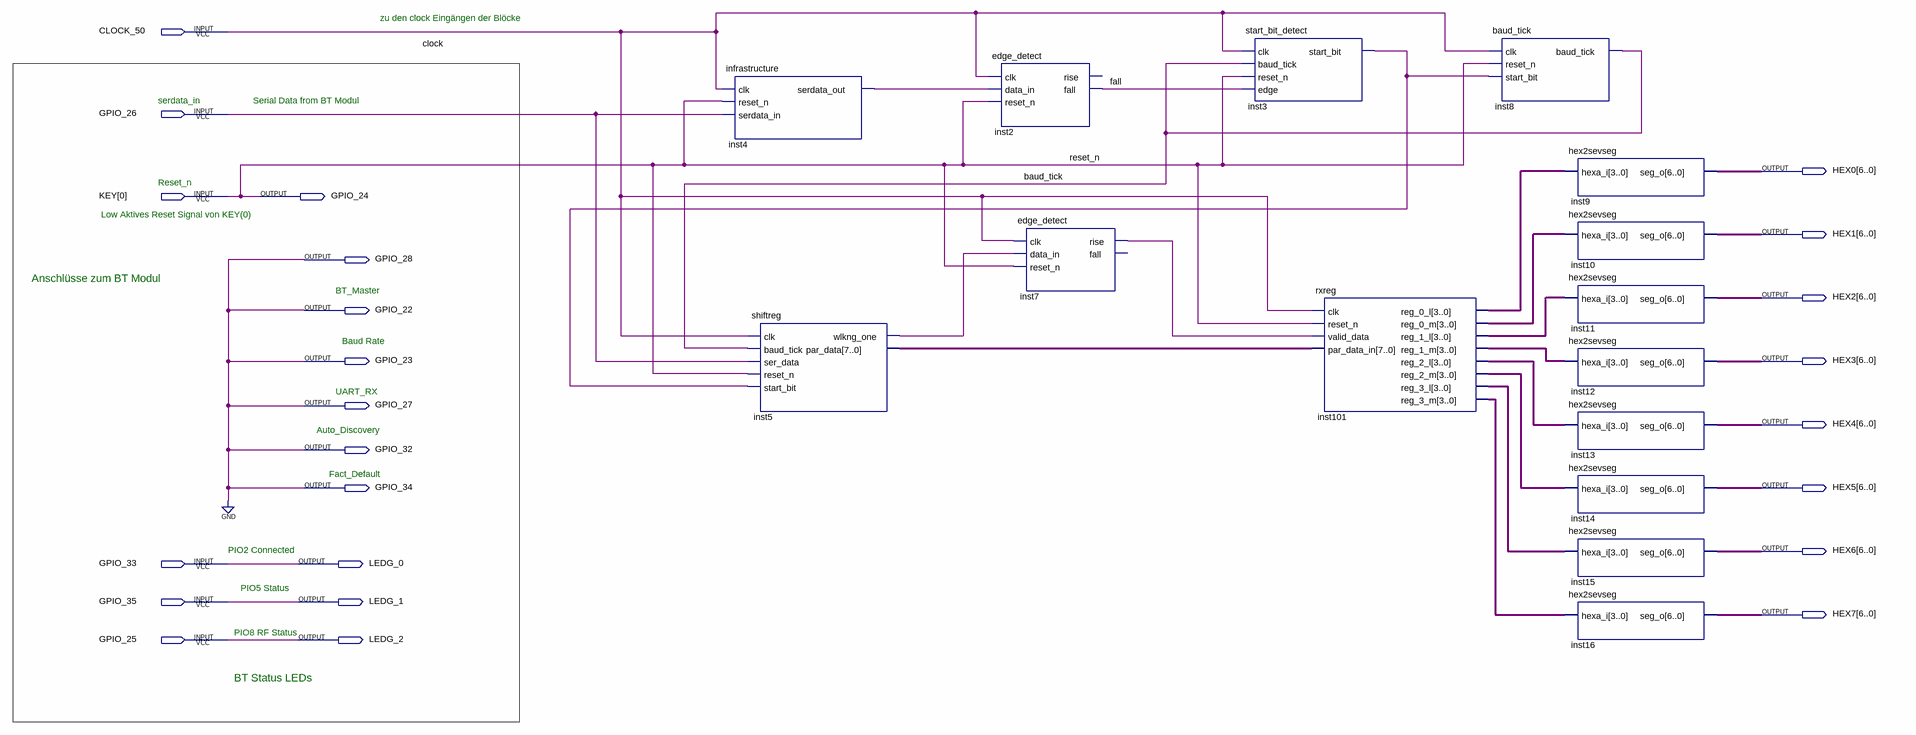
[diagram p0: schematic sheet]
// Quartus schematic bluetooth_top.bdf as structural Verilog: 15 symbols, 24 pins
module bluetooth_top (
  input  CLOCK_50,
  input  GPIO_26,
  input  [0:0] KEY,
  input  GPIO_33,
  input  GPIO_35,
  input  GPIO_25,
  output [6:0] HEX0,
  output GPIO_24,
  output [6:0] HEX1,
  output GPIO_28,
  output [6:0] HEX2,
  output GPIO_22,
  output GPIO_23,
  output [6:0] HEX3,
  output GPIO_27,
  output [6:0] HEX4,
  output GPIO_32,
  output GPIO_34,
  output [6:0] HEX5,
  output [6:0] HEX6,
  output LEDG_0,
  output LEDG_1,
  output [6:0] HEX7,
  output LEDG_2
);

  wire baud_tick, fall, inst3_start_bit, inst4_serdata_out, inst5_wlkng_one, inst7_rise;
  wire [3:0] inst101_reg_0_l, inst101_reg_0_m, inst101_reg_1_l, inst101_reg_1_m, inst101_reg_2_l,
       inst101_reg_2_m, inst101_reg_3_l, inst101_reg_3_m;
  wire [7:0] inst5_par_data;

  infrastructure inst4 (.clk(CLOCK_50), .reset_n(KEY[0]), .serdata_in(GPIO_26), .serdata_out(inst4_serdata_out));
  shiftreg inst5 (
    .clk(CLOCK_50), .baud_tick(baud_tick), .ser_data(GPIO_26), .reset_n(KEY[0]), .start_bit(inst3_start_bit),
    .wlkng_one(inst5_wlkng_one), .par_data(inst5_par_data));
  edge_detect inst2 (.clk(CLOCK_50), .data_in(inst4_serdata_out), .reset_n(KEY[0]), .fall(fall));  // open: rise
  edge_detect inst7 (.clk(CLOCK_50), .data_in(inst5_wlkng_one), .reset_n(KEY[0]), .rise(inst7_rise));  // open: fall
  start_bit_detect inst3 (
    .clk(CLOCK_50), .baud_tick(baud_tick), .reset_n(KEY[0]), .\edge (fall), .start_bit(inst3_start_bit));
  rxreg inst101 (
    .clk(CLOCK_50), .reset_n(KEY[0]), .valid_data(inst7_rise), .par_data_in(inst5_par_data),
    .reg_0_l(inst101_reg_0_l), .reg_0_m(inst101_reg_0_m), .reg_1_l(inst101_reg_1_l),
    .reg_1_m(inst101_reg_1_m), .reg_2_l(inst101_reg_2_l), .reg_2_m(inst101_reg_2_m),
    .reg_3_l(inst101_reg_3_l), .reg_3_m(inst101_reg_3_m));
  baud_tick inst8 (.clk(CLOCK_50), .reset_n(KEY[0]), .start_bit(inst3_start_bit), .baud_tick(baud_tick));
  hex2sevseg inst9 (.hexa_i(inst101_reg_0_l), .seg_o(HEX0));
  hex2sevseg inst10 (.hexa_i(inst101_reg_0_m), .seg_o(HEX1));
  hex2sevseg inst11 (.hexa_i(inst101_reg_1_l), .seg_o(HEX2));
  hex2sevseg inst12 (.hexa_i(inst101_reg_1_m), .seg_o(HEX3));
  hex2sevseg inst13 (.hexa_i(inst101_reg_2_l), .seg_o(HEX4));
  hex2sevseg inst14 (.hexa_i(inst101_reg_2_m), .seg_o(HEX5));
  hex2sevseg inst15 (.hexa_i(inst101_reg_3_l), .seg_o(HEX6));
  hex2sevseg inst16 (.hexa_i(inst101_reg_3_m), .seg_o(HEX7));

  assign GPIO_22 = 1'b0;
  assign GPIO_23 = 1'b0;
  assign GPIO_24 = KEY[0];
  assign GPIO_27 = 1'b0;
  assign GPIO_28 = 1'b0;
  assign GPIO_32 = 1'b0;
  assign GPIO_34 = 1'b0;
  assign LEDG_0 = GPIO_33;
  assign LEDG_1 = GPIO_35;
  assign LEDG_2 = GPIO_25;

  // Other names for the same wires on the sheet: clock = CLOCK_50; reset_n = KEY[0]

  // Notes on the sheet:
  //   zu den clock Eingängen der Blöcke
  //   serdata_in
  //   Serial Data from BT Modul
  //   Reset_n
  //   Low Aktives Reset Signal von KEY(0)
  //   Anschlüsse zum BT Modul
  //   BT_Master
  //   Baud Rate
  //   UART_RX
  //   Auto_Discovery
  //   Fact_Default
  //   PIO2 Connected
  //   PIO5 Status
  //   PIO8 RF Status
  //   BT Status LEDs
endmodule
